# EAGLE design Sceme (EAGLE 9.6.2)
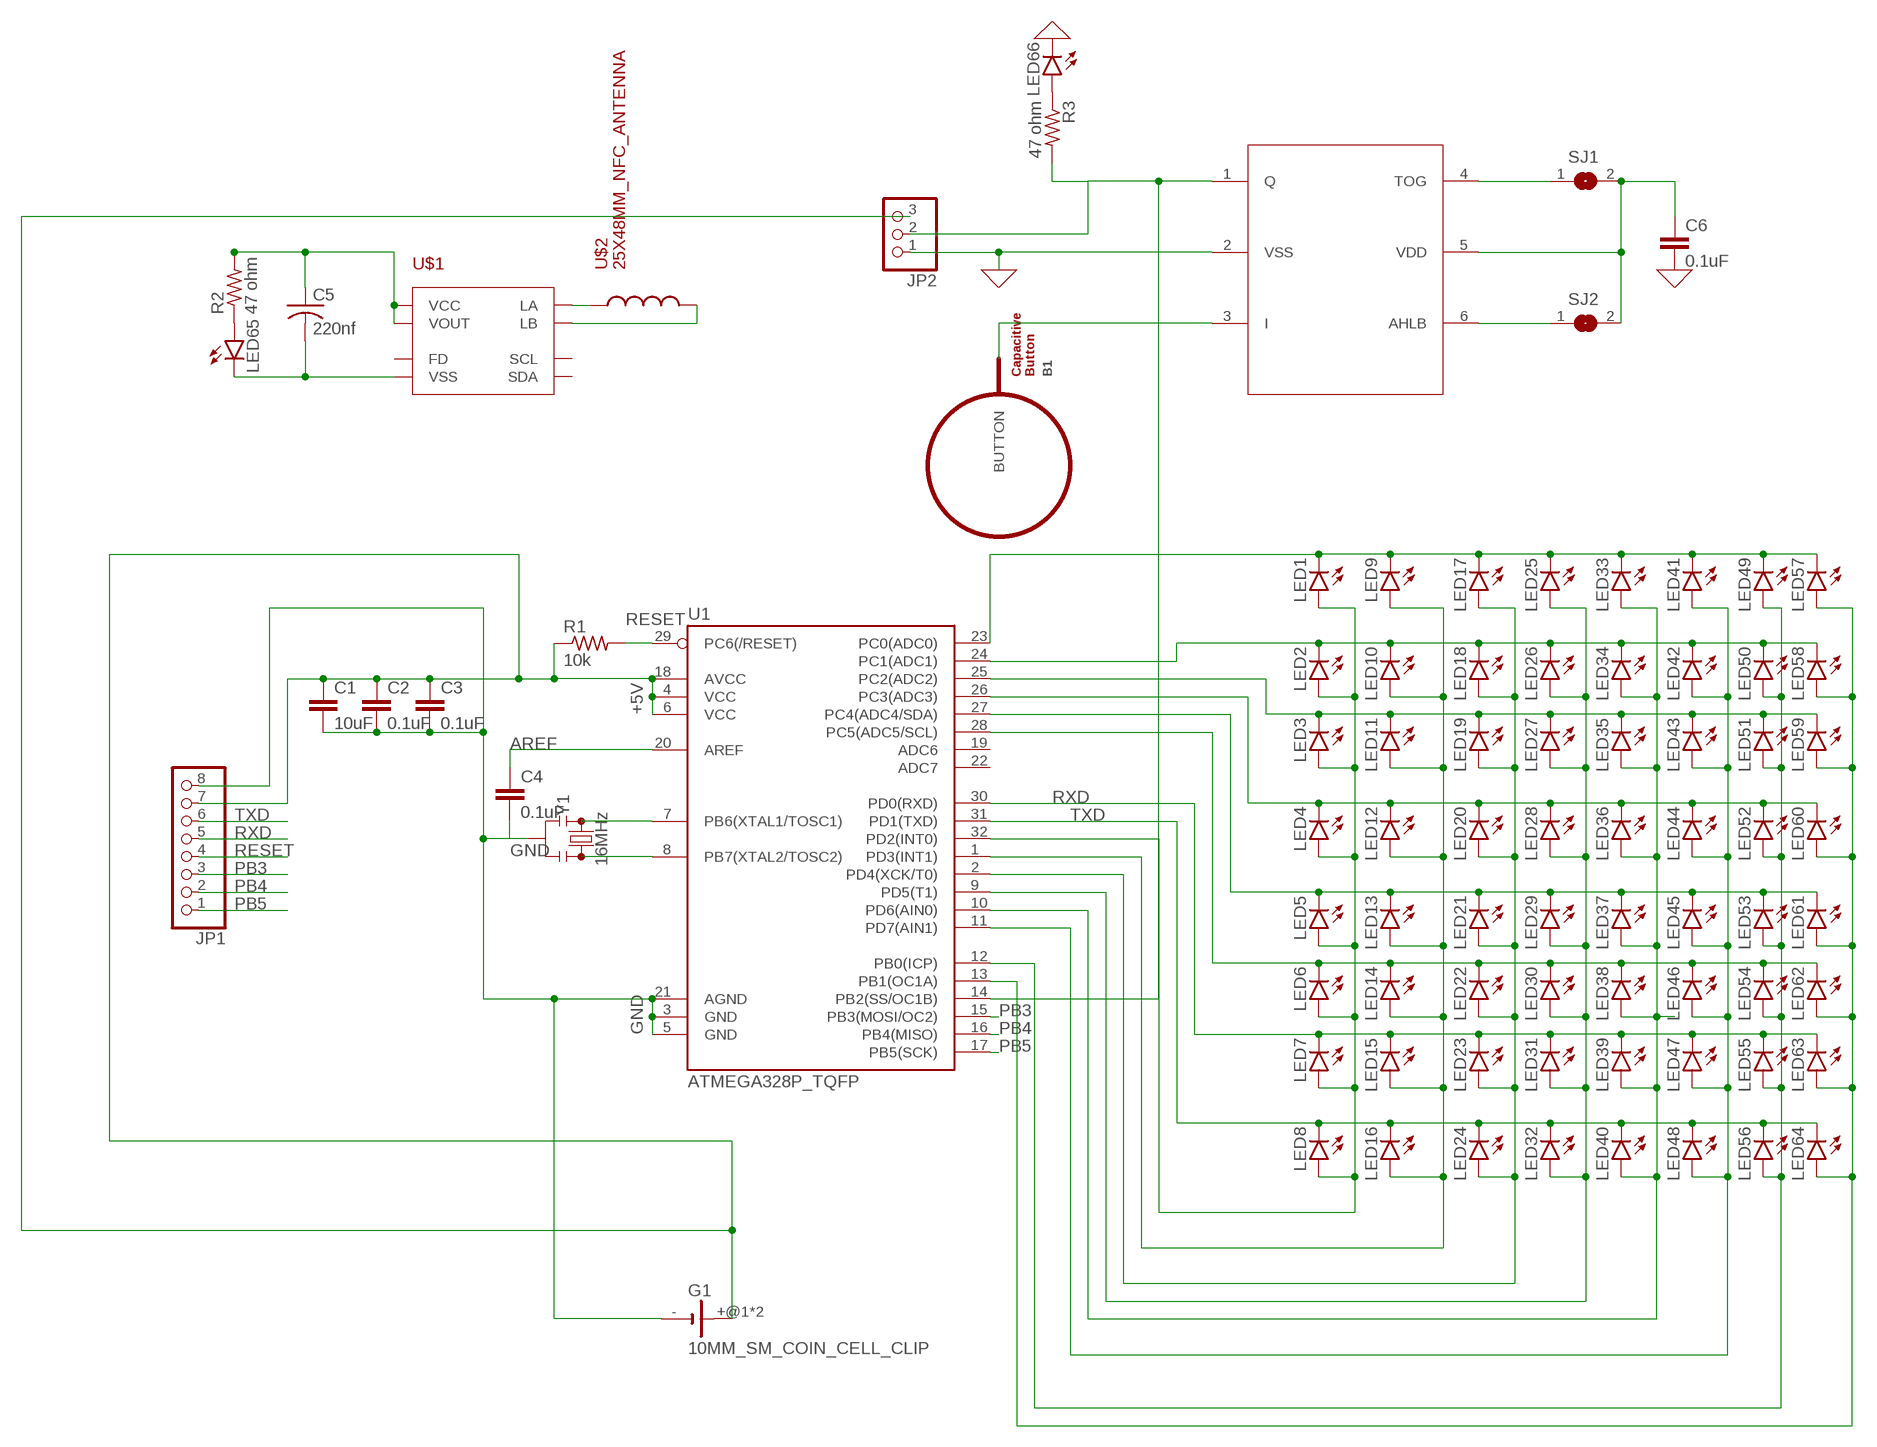
[diagram p0: schematic, sheet 1]
U$7 (TTP223): S: s
U$8 (TTP223): S: s

## Parts
B1  BUTTON_PASSIVE8MM  [BUTTON_PASSIVE_8MM]
C1  10uF  C-EUC0603  [C0603]
C2  0.1uF  C-EUC0603  [C0603]
C3  0.1uF  C-EUC0603  [C0603]
C4  0.1uF  C-EUC0603  [C0603]
C5  220nf  C-USC0805  [C0805]
C6  0.1uF  C-EUC0603  [C0603]
G1  10MM_SM_COIN_CELL_CLIP  [10MM_SM_COIN_CELL_CLIP]
JP1  PINHD-1X8  [1X08]
JP2  PINHD-1X3  [1X03]
LED1  LED  [SMARTLED-TTW]
LED2  LED  [SMARTLED-TTW]
LED3  LED  [SMARTLED-TTW]
LED4  LED  [SMARTLED-TTW]
LED5  LED  [SMARTLED-TTW]
LED6  LED  [SMARTLED-TTW]
LED7  LED  [SMARTLED-TTW]
LED8  LED  [SMARTLED-TTW]
LED9  LED  [SMARTLED-TTW]
LED10  LED  [SMARTLED-TTW]
LED11  LED  [SMARTLED-TTW]
LED12  LED  [SMARTLED-TTW]
LED13  LED  [SMARTLED-TTW]
LED14  LED  [SMARTLED-TTW]
LED15  LED  [SMARTLED-TTW]
LED16  LED  [SMARTLED-TTW]
LED17  LED  [SMARTLED-TTW]
LED18  LED  [SMARTLED-TTW]
LED19  LED  [SMARTLED-TTW]
LED20  LED  [SMARTLED-TTW]
LED21  LED  [SMARTLED-TTW]
LED22  LED  [SMARTLED-TTW]
LED23  LED  [SMARTLED-TTW]
LED24  LED  [SMARTLED-TTW]
LED25  LED  [SMARTLED-TTW]
LED26  LED  [SMARTLED-TTW]
LED27  LED  [SMARTLED-TTW]
LED28  LED  [SMARTLED-TTW]
LED29  LED  [SMARTLED-TTW]
LED30  LED  [SMARTLED-TTW]
LED31  LED  [SMARTLED-TTW]
LED32  LED  [SMARTLED-TTW]
LED33  LED  [SMARTLED-TTW]
LED34  LED  [SMARTLED-TTW]
LED35  LED  [SMARTLED-TTW]
LED36  LED  [SMARTLED-TTW]
LED37  LED  [SMARTLED-TTW]
LED38  LED  [SMARTLED-TTW]
LED39  LED  [SMARTLED-TTW]
LED40  LED  [SMARTLED-TTW]
LED41  LED  [SMARTLED-TTW]
LED42  LED  [SMARTLED-TTW]
LED43  LED  [SMARTLED-TTW]
LED44  LED  [SMARTLED-TTW]
LED45  LED  [SMARTLED-TTW]
LED46  LED  [SMARTLED-TTW]
LED47  LED  [SMARTLED-TTW]
LED48  LED  [SMARTLED-TTW]
LED49  LED  [SMARTLED-TTW]
LED50  LED  [SMARTLED-TTW]
LED51  LED  [SMARTLED-TTW]
LED52  LED  [SMARTLED-TTW]
LED53  LED  [SMARTLED-TTW]
LED54  LED  [SMARTLED-TTW]
LED55  LED  [SMARTLED-TTW]
LED56  LED  [SMARTLED-TTW]
LED57  LED  [SMARTLED-TTW]
LED58  LED  [SMARTLED-TTW]
LED59  LED  [SMARTLED-TTW]
LED60  LED  [SMARTLED-TTW]
LED61  LED  [SMARTLED-TTW]
LED62  LED  [SMARTLED-TTW]
LED63  LED  [SMARTLED-TTW]
LED64  LED  [SMARTLED-TTW]
LED65  LEDSML0805  [SML0805]
LED66  LEDSML0805  [SML0805]
R1  10k  R-US_R0603  [R0603]
R2  47 ohm  R-US_R0805  [R0805]
R3  47 ohm  R-US_R0805  [R0805]
SJ1  SJ  [SJ]
SJ2  SJ  [SJ]
U1  ATMEGA328P_TQFP  [TQFP32-08]
U$1  NT3H  [XQFN8]
U$2  25X48MM_NFC_ANTENNA  [25X48MM_NFC_ANTENNA]
U$9  TTP223  [SOT23-6]
Y1  16MHz  RESONATOR-16MHZSMD_3.2X1.3  [RESONATOR-SMD-3.2X1.3]

## Nets
0: C6.2 JP2.1 LED66.C U$9.2(VSS) ; supply symbol labelled GND
+5V: C1.1 C2.1 C3.1 G1.+@1(+) G1.+@2(+) JP1.7 JP2.3 R1.1 U1.4(VCC) U1.6(VCC) U1.18(AVCC)
AREF: C4.1 U1.20(AREF)
GND: C1.2 C2.2 C3.2 C4.2 G1.- JP1.8 U1.3(GND) U1.5(GND) U1.21(AGND) Y1.2
N$1: LED1.C@1(C) LED9.C@1(C) LED17.C@1(C) LED25.C@1(C) LED33.C@1(C) LED41.C@1(C) LED49.C@1(C) LED57.C@1(C) U1.23(PC0(ADC0))
N$2: LED2.C@1(C) LED10.C@1(C) LED18.C@1(C) LED26.C@1(C) LED34.C@1(C) LED42.C@1(C) LED50.C@1(C) LED58.C@1(C) U1.24(PC1(ADC1))
N$3: LED3.C@1(C) LED11.C@1(C) LED19.C@1(C) LED27.C@1(C) LED35.C@1(C) LED43.C@1(C) LED51.C@1(C) LED59.C@1(C) U1.25(PC2(ADC2))
N$4: LED4.C@1(C) LED12.C@1(C) LED20.C@1(C) LED28.C@1(C) LED36.C@1(C) LED44.C@1(C) LED52.C@1(C) LED60.C@1(C) U1.26(PC3(ADC3))
N$5: LED5.C@1(C) LED13.C@1(C) LED21.C@1(C) LED29.C@1(C) LED37.C@1(C) LED45.C@1(C) LED53.C@1(C) LED61.C@1(C) U1.27(PC4(ADC4/SDA))
N$6: LED6.C@1(C) LED14.C@1(C) LED22.C@1(C) LED30.C@1(C) LED38.C@1(C) LED46.C@1(C) LED54.C@1(C) LED62.C@1(C) U1.28(PC5(ADC5/SCL))
N$7: U$1.LA U$2.P$1
N$8: U$1.LB U$2.P$2
N$9: LED1.A@1(A) LED2.A@1(A) LED3.A@1(A) LED4.A@1(A) LED5.A@1(A) LED6.A@1(A) LED7.A@1(A) LED8.A@1(A) U1.32(PD2(INT0))
N$10: LED9.A@1(A) LED10.A@1(A) LED11.A@1(A) LED12.A@1(A) LED13.A@1(A) LED14.A@1(A) LED15.A@1(A) LED16.A@1(A) U1.1(PD3(INT1))
N$11: LED17.A@1(A) LED18.A@1(A) LED19.A@1(A) LED20.A@1(A) LED21.A@1(A) LED22.A@1(A) LED23.A@1(A) LED24.A@1(A) U1.2(PD4(XCK/T0))
N$12: LED25.A@1(A) LED26.A@1(A) LED27.A@1(A) LED28.A@1(A) LED29.A@1(A) LED30.A@1(A) LED31.A@1(A) LED32.A@1(A) U1.9(PD5(T1))
N$13: LED33.A@1(A) LED34.A@1(A) LED35.A@1(A) LED36.A@1(A) LED37.A@1(A) LED38.A@1(A) LED39.A@1(A) LED40.A@1(A) U1.10(PD6(AIN0))
N$14: LED41.A@1(A) LED42.A@1(A) LED43.A@1(A) LED44.A@1(A) LED45.A@1(A) LED46.A@1(A) LED47.A@1(A) LED48.A@1(A) U1.11(PD7(AIN1))
N$15: LED49.A@1(A) LED50.A@1(A) LED51.A@1(A) LED52.A@1(A) LED53.A@1(A) LED54.A@1(A) LED55.A@1(A) LED56.A@1(A) U1.12(PB0(ICP))
N$16: LED57.A@1(A) LED58.A@1(A) LED59.A@1(A) LED60.A@1(A) LED61.A@1(A) LED62.A@1(A) LED63.A@1(A) LED64.A@1(A) U1.13(PB1(OC1A))
N$17: U1.7(PB6(XTAL1/TOSC1)) Y1.1
N$18: U1.8(PB7(XTAL2/TOSC2)) Y1.3
N$19: LED65.A R2.1
N$20: C5.1 R2.2 U$1.VCC U$1.VOUT
N$21: C5.2 LED65.C U$1.VSS
N$22: LED66.A R3.1
N$23: JP2.2 R3.2 U1.14(PB2(SS/OC1B)) U$9.1(Q)
N$24: B1.BUTTON U$9.3(I)
N$25: SJ1.1 U$9.4(TOG)
N$26: SJ2.1 U$9.6(AHLB)
N$27: C6.1 SJ1.2 SJ2.2 U$9.5(VDD)
PB3: JP1.3 U1.15(PB3(MOSI/OC2))
PB4: JP1.2 U1.16(PB4(MISO))
PB5: JP1.1 U1.17(PB5(SCK))
RESET: JP1.4 R1.2 U1.29(PC6(/RESET))
RXD: JP1.5 LED7.C@1(C) LED15.C@1(C) LED23.C@1(C) LED31.C@1(C) LED39.C@1(C) LED47.C@1(C) LED55.C@1(C) LED63.C@1(C) U1.30(PD0(RXD))
TXD: JP1.6 LED8.C@1(C) LED16.C@1(C) LED24.C@1(C) LED32.C@1(C) LED40.C@1(C) LED48.C@1(C) LED56.C@1(C) LED64.C@1(C) U1.31(PD1(TXD))
Unconnected: U1.19(ADC6) U1.22(ADC7) U$1.FD U$1.SCL U$1.SDA

## Library data of the parts
B1 = PatternAgents-TouchWidgets:BUTTON_PASSIVE: Button, Passive Capacitive/Touch Sensing Type Source : http://www.PatternAgents.com Github : https://github.com/PatternAgents License : http://creativecommons.org/licenses/by-sa/3.1/ (Creative Commons 3.1) THIS SOFTWARE IS PROVIDED BY THE CONTRIBUTORS "AS IS" AND WITHOUT ANY EXPRESS OR IMPLIED WARRANTIES, INCLUDING, BUT NOT LIMITED TO, THE IMPLIED WARRANTIES OF MERCHANTABILITY AND FITNESS FOR A PARTICULAR PURPOSE ARE DISCLAIMED. IN NO EVENT SHALL THE COPYRIGHT OWNER OR CONTRIBUTORS BE LIABLE FOR ANY DIRECT, INDIRECT, INCIDENTAL, SPECIAL, EXEMPLARY, OR CONSEQUENTIAL DAMAGES (INCLUDING, BUT NOT LIMITED TO, PROCUREMENT OF SUBSTITUTE GOODS OR SERVICES; LOSS OF USE, DATA, OR PROFITS; OR BUSINESS INTERRUPTION) HOWEVER CAUSED AND ON ANY THEORY OF LIABILITY, WHETHER IN CONTRACT, STRICT LIABILITY, OR TORT (INCLUDING NEGLIGENCE OR OTHERWISE) ARISING IN ANY WAY OUT OF THE USE OF THIS SOFTWARE, EVEN IF ADVISED OF THE POSSIBILITY OF SUCH DAMAGE.
C1-C4 C6 = rcl:C-EU: CAPACITOR, European symbol; SPICEPREFIX: C
C5 = adafruit:C-US: CAPACITOR, American symbol
G1 = battery:10MM_SM_COIN_CELL_CLIP: Battery cell clip for CR927 Source: KEYSTONE ELECTRONICS CORP. www.keyelco.com, ASTORIA, N.Y. 11105-2017 PART ANME 10mm SM COIN CELl CLIP DWG NO. 3030
JP1 = pinhead:PINHD-1X8: PIN HEADER
JP2 = adafruit:PINHD-1X3: PIN HEADER
LED1-LED66 = led:LED: LED OSRAM: - CHIPLED LG R971, LG N971, LY N971, LG Q971, LY Q971, LO R971, LY R971 LH N974, LH R974 LS Q976, LO Q976, LY Q976 LO Q996 - Hyper CHIPLED LW Q18S LB Q993, LB Q99A, LB R99A - SideLED LS A670, LO A670, LY A670, LG A670, LP A670 LB A673, LV A673, LT A673, LW A673 LH A674 LY A675 LS A676, LA A676, LO A676, LY A676, LW A676 LS A679, LY A679, LG A679 - Hyper Micro SIDELED® LS Y876, LA Y876, LO Y876, LY Y876 LT Y87S - SmartLED LW L88C, LW L88S LB L89C, LB L89S, LG L890 LS L89K, LO L89K, LY L89K LS L896, LA L896, LO L896, LY L896 - TOPLED LS T670, LO T670, LY T670, LG T670, LP T670 LSG T670, LSP T670, LSY T670, LOP T670, LYG T670 LG T671, LOG T671, LSG T671 LB T673, LV T673, LT T673, LW T673 LH T674 LS T676, LA T676, LO T676, LY T676, LB T676, LH T676, LSB T676, LW T676 LB T67C, LV T67C, LT T67C, LS T67K, LO T67K, LY T67K, LW E67C LS E67B, LA E67B, LO E67B, LY E67B, LB E67C, LV E67C, LT E67C LW T67C LS T679, LY T679, LG T679 LS T770, LO T770, LY T770, LG T770, LP T770 LB T773, LV T773, LT T773, LW T773 LH T774 LS E675, LA E675, LY E675, LS T675 LS T776, LA T776, LO T776, LY T776, LB T776 LHGB T686 LT T68C, LB T68C - Hyper Mini TOPLED® LB M676 - Mini TOPLED Santana® LG M470 LS M47K, LO M47K, LY M47K Source: http://www.osram.convergy.de LUXEON: - LUMILED® LXK2-PW12-R00, LXK2-PW12-S00, LXK2-PW14-U00, LXK2-PW14-V00 LXK2-PM12-R00, LXK2-PM12-S00, LXK2-PM14-U00 LXK2-PE12-Q00, LXK2-PE12-R00, LXK2-PE12-S00, LXK2-PE14-T00, LXK2-PE14-U00 LXK2-PB12-K00, LXK2-PB12-L00, LXK2-PB12-M00, LXK2-PB14-N00, LXK2-PB14-P00, LXK2-PB14-Q00 LXK2-PR12-L00, LXK2-PR12-M00, LXK2-PR14-Q00, LXK2-PR14-R00 LXK2-PD12-Q00, LXK2-PD12-R00, LXK2-PD12-S00 LXK2-PH12-R00, LXK2-PH12-S00 LXK2-PL12-P00, LXK2-PL12-Q00, LXK2-PL12-R00 Source: www.luxeon.com KINGBRIGHT: KA-3528ASYC Source: www.kingbright.com
R1 = rcl:R-US_: RESISTOR, American symbol; SPICEPREFIX: R
R2 R3 = adafruit:R-US_: RESISTOR, American symbol
SJ1 SJ2 = jumper:SJ: SMD solder JUMPER
U1 = a_personal:ATMEGA328P_TQFP; PROD_ID: IC-09069
U$1 = FQV3JXVJRBBMXRR:NT3H: NXP NTAG NT3H
U$2 = FQV3JXVJRBBMXRR:25X48MM_NFC_ANTENNA: 25x48 mm NFC loop antenna, L = 2,75 µH
U$9 = To2223:TTP223; S: s
Y1 = a_personal:RESONATOR-16MHZ: 16MHz Resonator Digikey Example <http://www.digikey.com/product-detail/en/murata-electronics-north-america/CSTCE16M0V53-R0/490-1198-1-ND/584635> Frequency: 16MHz Frequency Stability: ±0.3% Frequency Tolerance: ±0.5% Capacitance: 15pF; PROD_ID: XTAL-08900

## Board
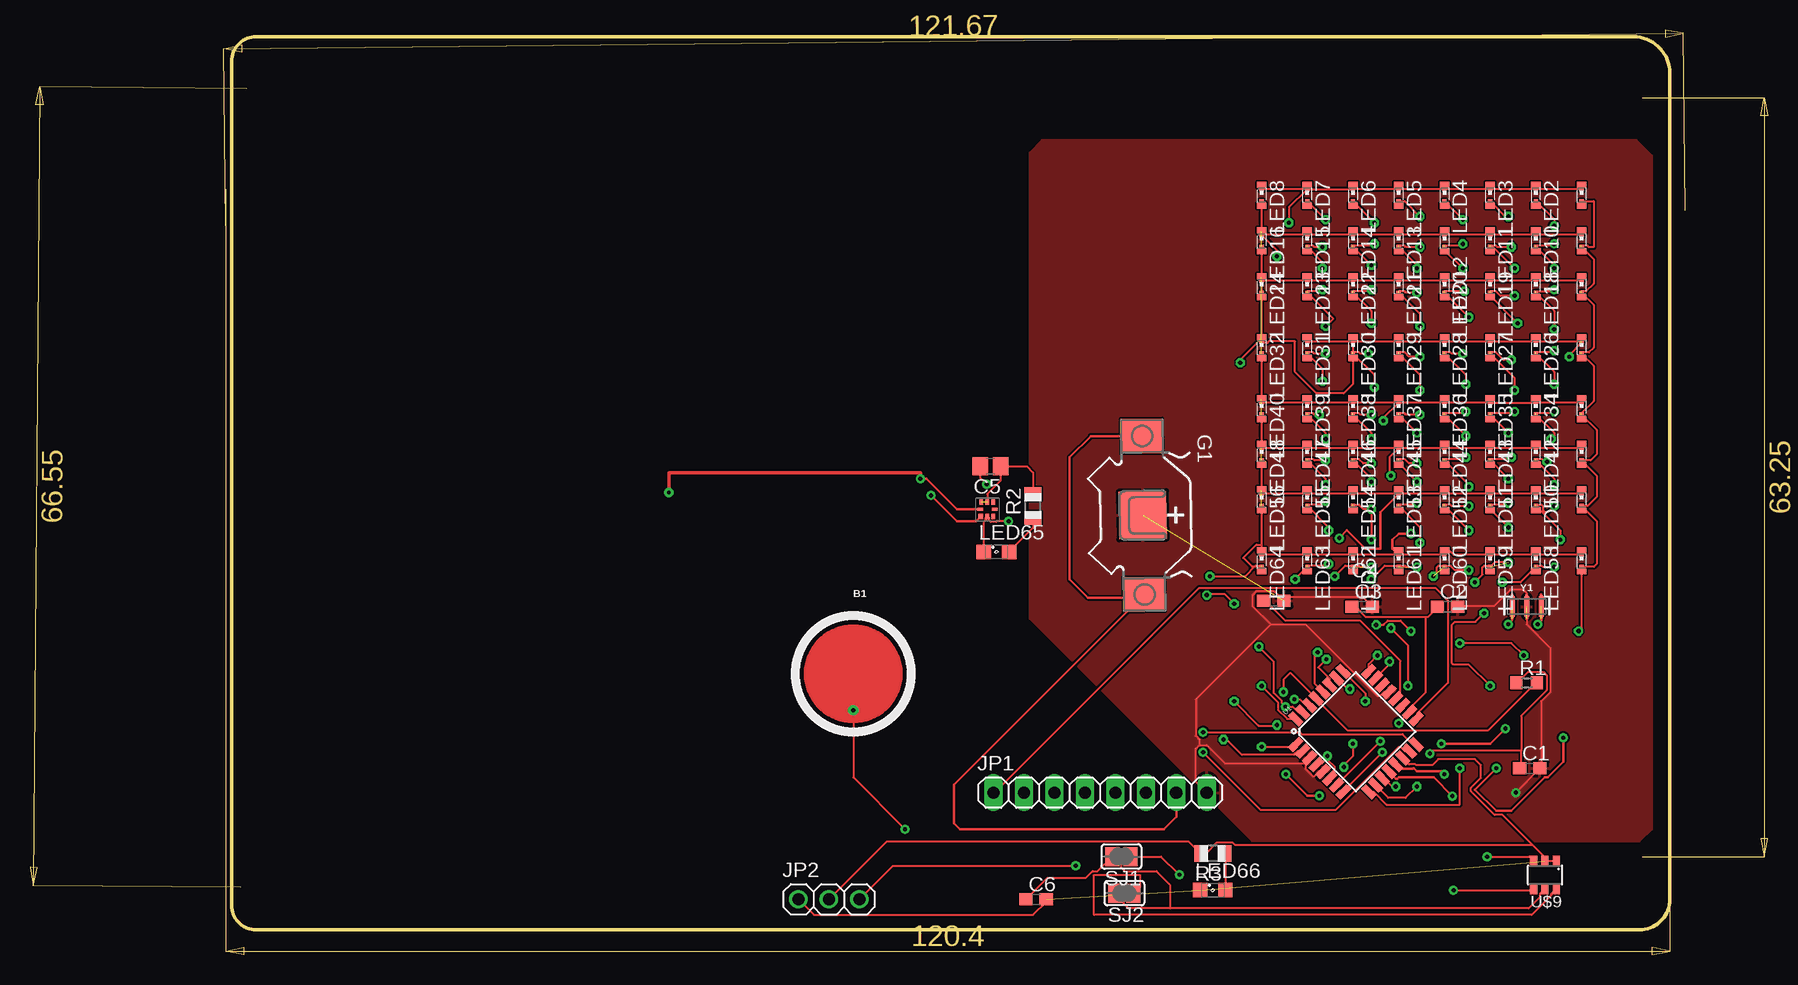
[diagram p1: board, top side]
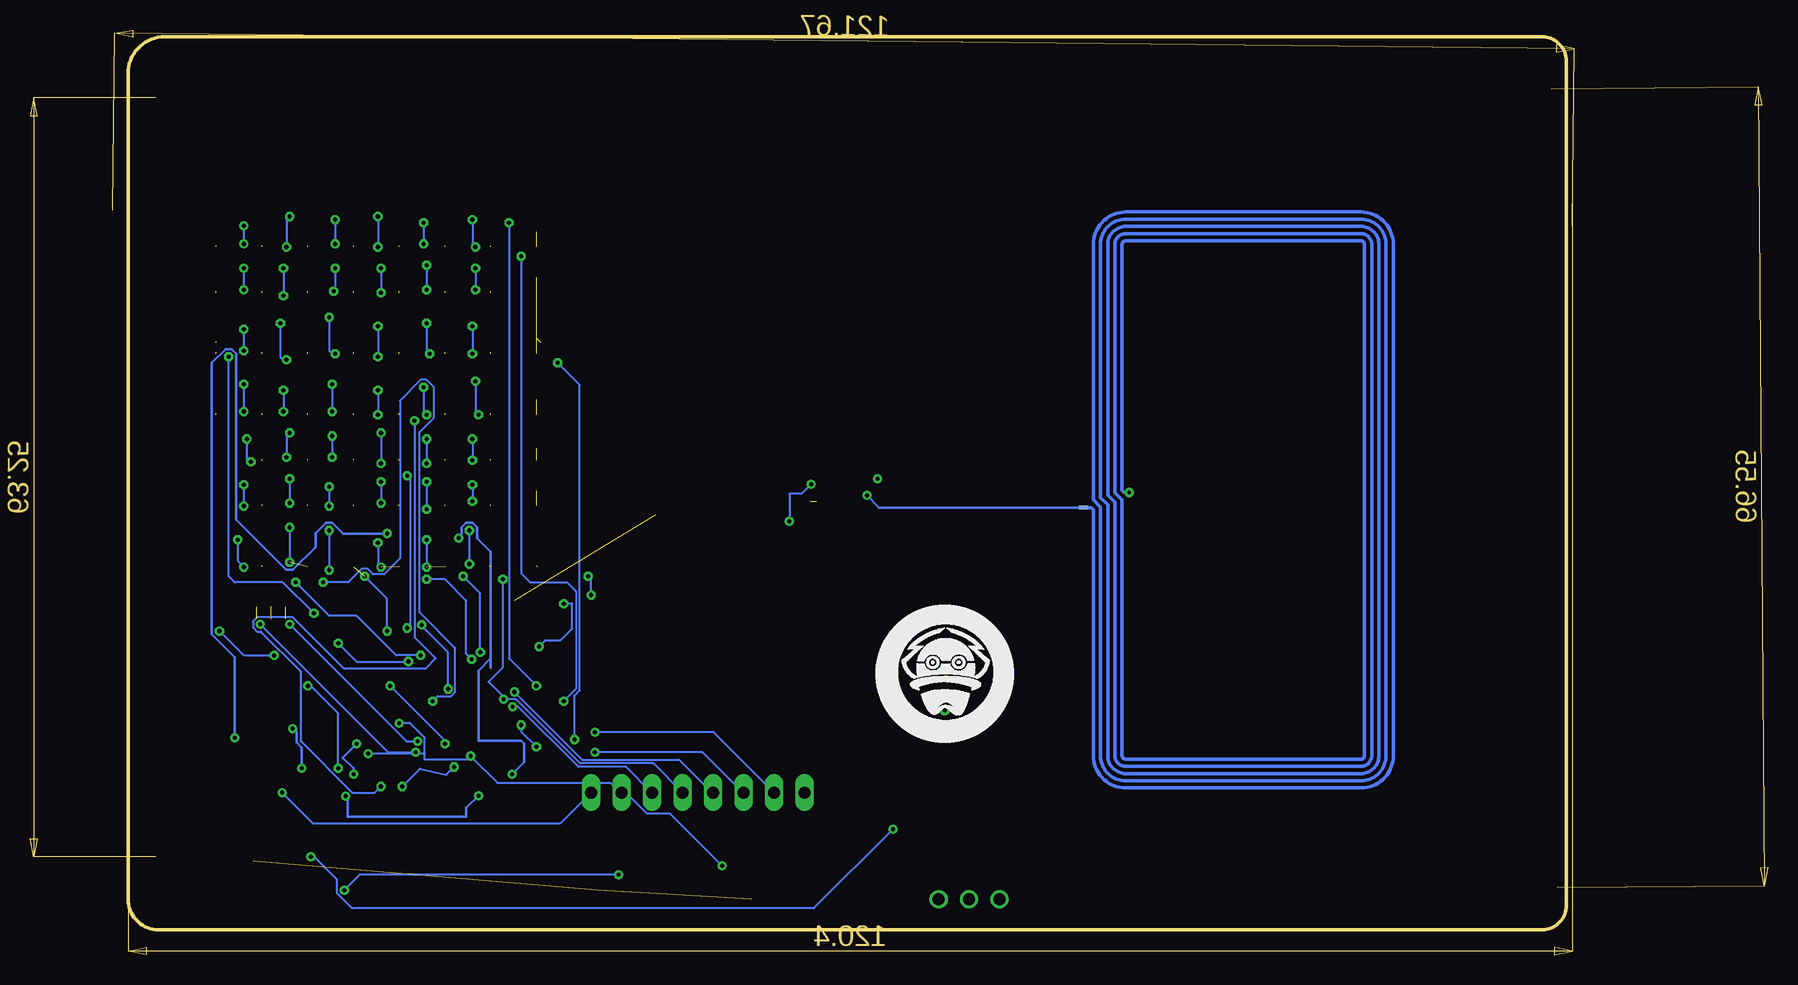
[diagram p2: board, bottom side, seen from below]

Size 119.89 x 74.42 mm. Coordinates in mm from the lower left corner, seen from the top.
Outline: 0,72.39 0,2.03 arc90 2.03,0 117.35,0 arc90 119.89,2.54 119.89,71.37 arc90 116.84,74.42 2.03,74.42 arc90 0,72.39
Copper layers (1*16): Top 0.035mm / dielectric 1.5mm / Bottom 0.035mm
Design rules "default": minimum track width 6mil, minimum drill 0.35mm, track to track 6mil, track to pad 6mil, pad to pad 6mil, via to via 6mil, smd to smd 6mil, copper to edge 40mil, drill to drill 6mil, minimum pad ring 10mil, minimum via ring 8mil, stop-mask expansion 4mil, vias tented up to drill 0mil, thermal gap 10mil

### Footprints (pad centres in the part's own frame; a part is rotated, then mirrored left to right if it is on the bottom)
BUTTON_PASSIVE_8MM = drill 0.356: BUTTON 0,3.048
C0603 = smd 1.1 x 1: 1 -0.85,0; 2 0.85,0
C0805 = smd 1.3 x 1.5: 1 -0.85,0; 2 0.85,0
10MM_SM_COIN_CELL_CLIP = smd 2.9 x 3.5: +@1 -6.6,0; +@2 6.6,0 | smd 3.96 x 3.96: - 0,0
1X08 = drill 1.016 long: 1 -8.89,0; 2 -6.35,0; 3 -3.81,0; 4 -1.27,0; 5 1.27,0; 6 3.81,0; 7 6.35,0; 8 8.89,0
1X03 = drill 1.016: 1 -2.54,0; 2 0,0; 3 2.54,0
SMARTLED-TTW = smd 0.8 x 0.5: A 0,-0.875; C 0,0.875 | smd 0.35 x 0.35: A@1 0,-0.5; C@1 0,0.5
SML0805 = smd 1.2 x 1.2: A 1.05,0; C -1.05,0
R0603 = smd 1 x 1.1: 1 -0.85,0; 2 0.85,0
R0805 = smd 1.1 x 1.4: 1 -1,0; 2 1,0
SJ = smd 1.168 x 1.6: 1 -0.762,0; 2 0.762,0
TQFP32-08 = smd 1.27 x 0.559: 1 -4.293,2.8; 2 -4.293,2; 3 -4.293,1.2; 4 -4.293,0.4; 5 -4.293,-0.4; 6 -4.293,-1.2; 7 -4.293,-2; 8 -4.293,-2.8; 17 4.293,-2.8; 18 4.293,-2; 19 4.293,-1.2; 20 4.293,-0.4; 21 4.293,0.4; 22 4.293,1.2; 23 4.293,2; 24 4.293,2.8 | smd 0.559 x 1.27: 9 -2.8,-4.293; 10 -2,-4.293; 11 -1.2,-4.293; 12 -0.4,-4.293; 13 0.4,-4.293; 14 1.2,-4.293; 15 2,-4.293; 16 2.8,-4.293; 25 2.8,4.293; 26 2,4.293; 27 1.2,4.293; 28 0.4,4.293; 29 -0.4,4.293; 30 -1.2,4.293; 31 -2,4.293; 32 -2.8,4.293
XQFN8 = smd 0.27 x 0.45: FD 0,-0.6; LB 0,0.6 | smd 0.45 x 0.37: LA -0.6,0.55 | smd 0.45 x 0.27: SCL -0.6,-0.5; SDA 0.6,-0.5; VCC 0.6,0; VOUT 0.6,0.5; VSS -0.6,0
25X48MM_NFC_ANTENNA = smd 0.3 x 0.75: P$1 -0.635,13.335 | drill 0.3: P$2 0.635,9.525
SOT23-6 = smd 0.6 x 0.9: 1 -0.95,-1.15; 2 0,-1.15; 3 0.95,-1.15; 4 0.95,1.15; 5 0,1.15; 6 -0.95,1.15
RESONATOR-SMD-3.2X1.3 = smd 0.45 x 1.905: 1 -1.2,0; 2 0,0; 3 1.2,0

### Placement (x,y rotation side)
B1  51.82,21.34 180 top
C1  108.2,13.46 0 top
C2  101.35,26.92 0 top
C3  94.23,26.92 0 top
C4  86.87,27.43 0 top
C5  63.25,38.61 180 top
C6  67.06,2.54 0 top
G1  75.95,34.54 270.9 top
JP1  72.39,11.43 0 top
JP2  49.78,2.54 0 top
LED1  112.52,61.21 180 top
LED2  108.71,61.21 180 top
LED3  104.9,61.21 180 top
LED4  101.09,61.21 180 top
LED5  97.28,61.21 180 top
LED6  93.47,61.21 180 top
LED7  89.66,61.21 180 top
LED8  85.85,61.21 180 top
LED9  112.52,57.4 180 top
LED10  108.71,57.4 180 top
LED11  104.9,57.4 180 top
LED12  101.09,57.4 180 top
LED13  97.28,57.4 180 top
LED14  93.47,57.4 180 top
LED15  89.66,57.4 180 top
LED16  85.85,57.4 180 top
LED17  112.52,53.59 180 top
LED18  108.71,53.59 180 top
LED19  104.9,53.59 180 top
LED20  101.09,53.59 180 top
LED21  97.28,53.59 180 top
LED22  93.47,53.59 180 top
LED23  89.66,53.59 180 top
LED24  85.85,53.59 180 top
LED25  112.52,48.51 180 top
LED26  108.71,48.51 180 top
LED27  104.9,48.51 180 top
LED28  101.09,48.51 180 top
LED29  97.28,48.51 180 top
LED30  93.47,48.51 180 top
LED31  89.66,48.51 180 top
LED32  85.85,48.51 180 top
LED33  112.52,43.43 180 top
LED34  108.71,43.43 180 top
LED35  104.9,43.43 180 top
LED36  101.09,43.43 180 top
LED37  97.28,43.43 180 top
LED38  93.47,43.43 180 top
LED39  89.66,43.43 180 top
LED40  85.85,43.43 180 top
LED41  112.52,39.62 180 top
LED42  108.71,39.62 180 top
LED43  104.9,39.62 180 top
LED44  101.09,39.62 180 top
LED45  97.28,39.62 180 top
LED46  93.47,39.62 180 top
LED47  89.66,39.62 180 top
LED48  85.85,39.62 180 top
LED49  112.52,35.81 180 top
LED50  108.71,35.81 180 top
LED51  104.9,35.81 180 top
LED52  101.09,35.81 180 top
LED53  97.28,35.81 180 top
LED54  93.47,35.81 180 top
LED55  89.66,35.81 180 top
LED56  85.85,35.81 180 top
LED57  112.52,30.73 180 top
LED58  108.71,30.73 180 top
LED59  104.9,30.73 180 top
LED60  101.09,30.73 180 top
LED61  97.28,30.73 180 top
LED62  93.47,30.73 180 top
LED63  89.66,30.73 180 top
LED64  85.85,30.73 180 top
LED65  63.75,31.5 0 top
LED66  81.79,3.3 0 top
R1  107.95,20.57 0 top
R2  66.8,35.31 90 top
R3  81.79,6.35 180 top
SJ1  74.17,6.1 180 top
SJ2  74.42,3.05 180 top
U1  93.73,16.51 45 top
U$1  62.99,35.05 90 top
U$2  26.92,35.81 90 bottom
U$9  109.47,4.57 180 top
Y1  107.95,26.92 0 top

### Tracks (layer width: path | path; a pad name or v marks a point on that pad's centre or on a via)
0  (2 unrouted)
  Top 0.152: JP2.1 48.54,1.25 66.8,1.25 67.91,2.35 C6.2
+5V  (via drill 0.35)
  Top 0.152: 99.52,26.06 99.72,26.06 100.48,26.82 C2.1 | 99.52,26.06 94.54,26.06 93.78,26.82 93.47,26.82 C3.1 | 99.52,26.06 99.52,19.76 98.2,18.44 98.2,18.14 U1.18 98.04,17.98 v97.28,17.22 | 107.49,14.94 107.49,17.83 109.63,19.96 109.63,21.18 109.32,21.49 108.1,21.49 107.19,20.57 R1.1 | C1.1 107.49,13.56 107.49,14.94 | 91.34,14.17 91.19,14.17 90.88,13.87 90.42,13.87 U1.4 | 91.34,14.17 91.95,13.56 91.95,12.95 91.64,12.65 U1.6 | v91.34,14.48 91.34,14.17 | v99.87,14.68 100.13,14.94 107.49,14.94 | JP2.3 55.12,5.33 v70.36,5.33
  Top 0.203: G1.+@2 76,27.89 | 76,27.89 60.2,12.09 60.2,8.89 60.71,8.38 77.72,8.38 78.74,9.4 JP1.7 | G1.+@1 71.62,41.14 69.85,39.37 69.85,29.21 71.37,27.69 76.71,27.69 76.5,27.89 76,27.89
  Bottom 0.152: 95.15,14.68 v99.87,14.68 | v97.28,17.22 96.37,17.22 95.15,16 95.15,14.68 | 95.15,14.68 95.15,14.17 91.64,14.17 v91.34,14.48 89.1,12.24 79.65,12.24 78.84,11.43 JP1.7 78.36,11.43 76.61,9.68 74.7,9.68 v70.36,5.33
AREF
  Top 0.152: C4.1 86.16,27.43 87.83,25.76 94.08,25.76 97.43,22.4 97.43,19.66 97.13,19.36 U1.20
GND  (via drill 0.35)  (2 unrouted)
  Top 0.152: 107.95,25.91 107.95,25.45 109.93,23.47 109.93,19.81 109.17,19.05 109.17,13.56 C1.2 109.02,13.41 v107.04,11.43 | C2.2 102.31,26.98 105.21,26.98 106.58,28.35 107.64,28.35 107.95,28.04 Y1.2 | 89.51,13.87 89.51,13.41 90.12,12.8 90.27,12.8 90.58,13.11 90.88,13.11 U1.5 | 89.51,13.87 89.81,14.17 U1.3 89.51,13.87 | 89.51,13.87 82.8,13.87 81.28,15.39 80.67,15.39 | 80.67,15.39 80.37,15.09 80.37,12.34 JP1.8 | C3.2 95,26.98 94.23,27.74 88.14,27.74 87.83,27.43 C4.2 87.68,27.43 86.92,28.19 85.39,28.19 85.09,27.89 85.09,26.98 86.61,25.45 | 86.61,25.45 89.51,25.45 95.45,19.51 95.76,19.51 96.06,19.81 96.37,19.81 U1.21 | 80.67,15.39 80.67,15.85 80.37,16.15 80.37,19.2 86.61,25.45
  Bottom 0.152: JP1.8 83.82,8.89 104.5,8.89 v107.04,11.43
  pour Top: 82.3,63.5 82.3,15.49 87.12,10.67 111.76,10.67 112.27,11.18 114.05,12.95 114.05,58.67 114.05,62.48 113.03,63.5
  pour Top: 66.55,64.77 66.55,25.91 85.09,7.37 117.35,7.37 118.36,8.38 118.36,64.52 117.09,65.79 67.56,65.79
  pour Top: 62.23,8.13 63.75,6.6 63.75,0.76 113.03,0.76 113.28,1.02 113.54,1.27 113.54,8.13
N$1  (via drill 0.35)  (4 unrouted)
  Top 0.152: LED1.C@1 113.54,60.71 113.54,56.9 113.13,56.9 113.02,57.01 112.52,57.01 | LED9.C@1 113.54,55.89 113.54,53.85 112.89,53.2 112.52,53.2 | LED17.C@1 113.54,52.08 113.54,48.51 113.14,48.12 112.52,48.12 | LED25.C@1 113.54,47 113.54,44.05 112.52,43.04 | LED33.C@1 113.79,41.66 113.79,39.62 113.29,39.12 LED41.C@1 113.79,37.85 113.79,36.07 113.04,35.31 LED49.C@1 113.79,34.04 113.79,30.48 113.55,30.23 LED57.C@1 112.52,25.15 v112.27,24.89 | v107.7,22.86 106.68,23.88 v102.36,23.88 | v96.52,22.35 96.52,22.13 U1.23
  Bottom 0.152: v112.27,24.89 110.24,22.86 v107.7,22.86 | v102.36,23.88 100.84,22.35 v96.52,22.35
N$2  (via drill 0.35)  (7 unrouted)
  Top 0.152: LED2.C@1 110.24,59.19 v110.24,58.67 | v110.24,57.15 110.09,57.01 108.71,57.01 | LED10.C@1 110.24,55.38 v110.24,55.12 | v110.24,53.34 110.09,53.2 108.71,53.2 | LED18.C@1 110.24,51.57 v110.24,50.04 | v110.24,48.26 110.09,48.12 108.71,48.12 | LED26.C@1 110.24,46.49 v110.24,45.47 | v110.24,43.18 110.09,43.04 108.71,43.04 | LED34.C@1 110.24,41.41 110.24,41.15 v109.98,40.89 | 108.71,39.23 109.21,39.23 109.44,38.99 v109.64,38.99 | LED42.C@1 110.24,37.6 v110.24,37.08 | v110.24,35.31 109.73,34.8 109.47,34.8 109.34,34.93 109.34,35.28 109.21,35.42 108.71,35.42 | LED50.C@1 110.74,33.28 v110.74,32.51 | v110.24,30.23 109.32,30.23 109.21,30.34 108.71,30.34 | LED58.C@1 107.43,28.96 v105.92,28.96 | U1.24 94.78,22.14 v95.5,22.86
  Bottom 0.152: v110.24,58.67 v110.24,57.15 | v110.24,55.12 v110.24,53.34 | v110.24,50.04 v110.24,48.26 | v110.24,45.47 v110.24,43.18 | v109.98,40.89 109.98,39.12 109.73,38.86 109.64,38.95 v109.64,38.99 | v110.24,37.08 v110.24,35.31 | v110.74,32.51 110.74,30.73 v110.24,30.23 | v95.5,22.86 97.54,22.86 100.84,26.16 103.12,26.16 v105.92,28.96
N$3  (via drill 0.35)  (7 unrouted)
  Top 0.152: LED3.C@1 106.18,59.44 v106.43,59.44 | v106.68,56.9 105.51,56.9 105.4,57.01 104.9,57.01 | LED11.C@1 105.15,56.9 v106.93,55.12 | 104.9,53.2 105.4,53.2 105.76,52.83 v106.93,52.83 | LED19.C@1 104.9,52.83 v107.19,50.55 | 104.9,48.12 105.4,48.12 106.02,47.5 v106.68,47.5 | LED27.C@1 106.93,45.98 v106.93,44.96 | v106.93,43.18 106.79,43.04 104.9,43.04 | LED35.C@1 v106.43,41.41 v106.43,41.4 | v106.68,39.37 106.54,39.23 104.9,39.23 | LED43.C@1 v106.43,37.6 v106.43,37.59 | v106.43,35.56 106.28,35.42 104.9,35.42 | LED51.C@1 104.9,35.05 v106.43,33.53 | v106.43,30.63 105.3,30.63 105.01,30.34 104.41,30.34 104.27,30.2 104.27,29.6 v103.63,28.96 | U1.25 94.49,19.71 v94.49,19.05
  Bottom 0.152: v106.43,59.44 106.68,59.18 v106.68,56.9 | v106.93,55.12 v106.93,52.83 | v107.19,50.55 107.19,47.75 106.93,47.5 v106.68,47.5 | v106.93,44.96 v106.93,43.18 | v106.43,41.4 106.68,41.15 v106.68,39.37 | v106.43,37.59 v106.43,35.56 | v106.43,33.53 v106.43,30.63 | v94.49,19.05 94.08,19.46 92.97,19.46 92.61,19.81 92.61,23.46 95.6,26.46 95.6,41.46 94.39,42.67 94.39,45.21 95,45.82 95.5,45.82 97.23,44.09 97.23,30.95 98.55,29.62 99.46,29.62 99.91,30.07 100.41,30.07 101.53,28.96 v103.63,28.96
N$4  (via drill 0.35)  (7 unrouted)
  Top 0.152: LED4.C@1 v102.62,59.19 v102.62,59.18 | v102.62,57.15 102.47,57.01 101.09,57.01 | LED12.C@1 101.09,56.64 v102.62,55.12 | v102.74,53.21 101.21,53.21 101.2,53.2 101.09,53.2 | LED20.C@1 v103.12,51.06 v103.12,51.05 | v102.62,48.01 101.7,48.01 101.59,48.12 101.09,48.12 | LED28.C@1 102.87,46.24 v102.87,45.47 | v102.87,43.18 102.73,43.04 101.09,43.04 | LED36.C@1 102.87,41.16 v102.87,41.15 | v102.87,39.37 102.73,39.23 101.09,39.23 | LED44.C@1 103.12,37.09 v103.12,36.92 | v103.12,35.31 101.7,35.31 101.59,35.42 101.09,35.42 | LED52.C@1 v103.12,33.28 v103.12,33.27 | v103.12,29.97 101.95,29.97 101.59,30.34 100.6,30.34 100.46,30.2 100.46,29.77 v100.16,29.46 | U1.26 93,20.07 v93.22,20.07 | 95.5,25.4 v95.41,25.4 96.02,25.4 96.37,25.75 97.44,25.75 v98.3,24.89
  Bottom 0.152: v102.62,59.18 v102.62,57.15 | v102.62,55.12 102.62,53.59 102.87,53.34 v102.74,53.21 | v103.12,51.05 103.12,48.26 102.87,48.01 v102.62,48.01 | v102.87,45.47 v102.87,43.18 | v102.87,41.15 v102.87,39.37 | v103.12,36.92 v103.12,35.31 | v103.12,33.27 v103.12,29.97 | v93.22,20.07 93.22,23.11 95.5,25.4 v95.41,25.4 | v98.3,24.89 98.3,27.6 v100.16,29.46
N$5  (via drill 0.35)  (7 unrouted)
  Top 0.152: LED5.C@1 97.78,60.71 v99.06,59.44 | v99.06,56.9 97.89,56.9 97.78,57.01 97.28,57.01 | LED13.C@1 98.81,55.38 v98.81,55.12 | v98.81,53.09 97.89,53.09 97.78,53.2 97.28,53.2 | LED21.C@1 99.06,51.32 v99.06,50.29 | 97.28,48.12 97.78,48.12 98.14,47.75 v99.06,47.75 | LED29.C@1 99.06,46.24 v99.06,44.96 | v99.06,42.93 97.89,42.93 97.78,43.04 97.28,43.04 | LED37.C@1 v98.81,41.41 v98.81,41.4 | 97.28,39.23 97.78,39.23 98.14,38.86 v98.81,38.86 | LED45.C@1 97.28,38.86 v98.81,37.34 | v98.81,35.56 98.66,35.42 97.28,35.42 | LED53.C@1 99.06,33.54 v99.06,32.26 | v98.81,30.23 97.89,30.23 97.78,30.34 96.12,30.34 v95,29.21 | U1.27 91.54,20.9 90.57,21.87 v91.24,22.55
  Bottom 0.152: v99.06,59.44 v99.06,56.9 | v98.81,55.12 v98.81,53.09 | v99.06,50.29 v99.06,47.75 | v99.06,44.96 v99.06,42.93 | v98.81,41.4 v98.81,38.86 | v98.81,37.34 v98.81,35.56 | v99.06,32.26 99.06,30.48 v98.81,30.23 | v91.24,22.55 91.69,23 91.69,27.43 93.47,29.21 v95,29.21
N$6  (via drill 0.35)  (7 unrouted)
  Top 0.152: LED6.C@1 95.25,58.94 v95.25,58.93 | v95.25,57.15 95.11,57.01 93.47,57.01 | LED14.C@1 v95,55.38 v95,55.37 | v95,53.34 94.85,53.2 93.47,53.2 | LED22.C@1 95,51.57 v95,50.55 | v94.74,48.01 94.08,48.01 93.97,48.12 93.47,48.12 | LED30.C@1 95.25,46.24 v95.25,45.21 | v95,42.93 94.08,42.93 93.97,43.04 93.47,43.04 | LED38.C@1 95,41.41 v95,40.89 | 93.47,39.23 93.97,39.23 94.33,38.86 v95,38.86 | LED46.C@1 95,37.6 v95,37.34 | 93.47,35.42 93.97,35.42 94.33,35.05 v95,35.05 v95,32.51 | v95,30.23 94.08,30.23 93.97,30.34 92.82,30.34 v91.95,29.46 | U1.28 90.27,20.53 90.27,22.86 v90.52,23.11
  Bottom 0.152: v95.25,58.93 v95.25,57.15 | v95,55.37 v95,53.34 | v95,50.55 95,48.26 v94.74,48.01 | v95.25,45.21 95.25,42.93 v95,42.93 | v95,40.89 v95,38.86 | v95,37.34 v95,35.05 | v95,32.51 v95,30.23 | v90.52,23.11 90.52,28.04 v91.95,29.46
N$7  (via drill 0.35)
  Top 0.203: v58.29,36.2 60.45,34.04 62.03,34.04 U$1.LA
  Bottom 0.203: U$2.P$1 57.28,35.18 v58.29,36.2
N$8  (via drill 0.35)
  Top 0.203: U$1.LB 60.45,35.05 57.91,37.59 v57.4,37.59
  Top 0.305: v57.4,37.59 57.4,38.1 36.45,38.1 U$2.P$2
N$9  (via drill 0.35)
  Top 0.152: LED1.A@1 LED2.A@1 LED3.A@1 LED4.A@1 LED5.A@1 LED6.A@1 LED7.A@1 | LED7.A@1 LED8.A@1 | LED7.A@1 88.14,60.19 v88.14,58.93 | v85.85,20.32 87.23,18.95 87.23,18.34 88,17.56 U1.32
  Bottom 0.152: v88.14,58.93 88.14,22.61 v85.85,20.32
N$10  (via drill 0.35)
  Top 0.152: LED9.A@1 LED10.A@1 LED11.A@1 LED12.A@1 LED13.A@1 LED14.A@1 LED15.A@1 LED16.A@1 87.12,56.63 v87.12,56.13 | v83.57,19.05 85.6,17.02 87.12,17.02 v87.12,17.07 | v85.85,15.24 88.5,15.24 U1.1
  Bottom 0.152: v87.12,56.13 87.12,29.72 86.36,28.96 83.31,28.96 82.55,28.19 82.55,20.07 v83.57,19.05 | v87.12,17.07 87.12,16.51 v85.85,15.24
N$11  (via drill 0.35)  (1 unrouted)
  Top 0.152: LED17.A@1 LED18.A@1 LED19.A@1 LED20.A@1 LED21.A@1 LED22.A@1 LED23.A@1 LED24.A@1 85.85,49.28 | U1.2 88.86,14.89 88.55,14.58 84.23,14.58 82.8,16 82.68,15.88 v82.68,15.85 | v84.07,47.24 84.07,47.5 85.45,48.87 85.45,48.91
  Bottom 0.152: v82.68,15.85 82.68,19.51 82.25,19.94 82.25,45.41 v84.07,47.24
N$12  (via drill 0.35)  (2 unrouted)
  Top 0.152: LED25.A@1 LED26.A@1 LED27.A@1 LED28.A@1 LED29.A@1 LED30.A@1 | LED30.A@1 LED31.A@1 | 85.85,48.91 86.35,48.91 86.48,49.04 88.62,49.04 88.65,49.02 88.65,46.48 90.42,44.7 92.71,44.7 93.47,45.47 LED30.A@1 | U1.9 95.19,11.5 96.27,10.42 102.36,10.42 v102.36,13.46 | v104.9,20.32 103.12,22.1 101.85,22.1 101.7,22.25 101.7,25.4 101.96,25.65 103.68,25.65 v104.39,26.37 | v111.51,47.75 111.51,47.89 112.52,48.91
  Bottom 0.152: v102.36,13.46 102.36,18.03 104.65,20.32 v104.9,20.32 | v104.39,26.37 106.98,28.96 111,28.96 111.51,29.46 v111.51,47.75
N$13  (via drill 0.35)
  Top 0.152: LED33.A@1 LED34.A@1 LED35.A@1 LED36.A@1 LED37.A@1 | LED37.A@1 LED38.A@1 LED39.A@1 LED40.A@1 | LED37.A@1 96.01,42.66 v96.01,42.42 | v98.81,11.94 97.86,10.99 96.42,10.99 U1.10
  Bottom 0.152: v96.01,42.42 96.01,24.38 94.23,22.61 95.09,21.75 101.86,21.75 106.17,26.06 109.12,26.06 109.47,25.7 109.47,25.2 109.12,24.84 108.82,24.84 105.51,21.53 105.51,15.75 101.19,11.43 99.31,11.43 v98.81,11.94
N$14  (via drill 0.35)
  Top 0.152: LED41.A@1 LED42.A@1 LED43.A@1 LED44.A@1 LED45.A@1 | LED45.A@1 LED46.A@1 LED47.A@1 LED48.A@1 | LED45.A@1 96.52,39.36 96.52,37.95 v96.62,37.85 | v96.62,25.15 98.04,23.72 v98.04,20.32 | v93.47,15.49 93.47,14.48 92.71,13.72 v92.71,13.57 | U1.11 96.07,12.63 96.77,11.93 96.77,11.94 v97.03,11.94
  Bottom 0.152: v96.62,37.85 96.36,37.59 96.36,25.4 v96.62,25.15 | v98.04,20.32 93.47,15.75 v93.47,15.49 | v92.71,13.57 93.37,12.91 95.54,13.42 v97.03,11.94
N$15  (via drill 0.35)
  Top 0.152: LED49.A@1 LED50.A@1 LED51.A@1 LED52.A@1 LED53.A@1 LED54.A@1 LED55.A@1 LED56.A@1
  Top 0.203: LED53.A@1 95.76,34.79 95.76,31.75 94.49,31.75 92.96,33.27 v92.33,32.64 | v87.88,12.95 89.66,11.18 v90.68,11.18 | v101.75,11.14 100.19,12.7 97.28,12.7 97.15,12.57 97.03,12.57 96.48,13.12 U1.12
  Bottom 0.203: v92.33,32.64 92.07,32.9 92.07,33.54 91.7,33.91 91.18,33.91 90.81,33.54 90.81,32.64 89.66,31.5 89.66,22.61 | 89.66,21.84 89.66,22.61 | 89.66,22.61 90.68,21.59 90.68,15.75 87.12,15.75 86.87,15.49 86.87,13.97 v87.88,12.95 | v90.68,11.18 91.69,10.16 91.69,9.4 101.6,9.4 101.6,11.18 101.64,11.14 v101.75,11.14
N$16  (via drill 0.35)
  Top 0.152: LED57.A@1 LED58.A@1 LED59.A@1 101.86,31.23 101.6,31.5 101.35,31.5 LED60.A@1 LED61.A@1 LED62.A@1 LED63.A@1 LED64.A@1
  Top 0.203: LED61.A@1 96.77,31.74 96.77,32.51 97.28,33.02 v98.3,33.02 | v111,16 111,14 109.71,12.71 109.48,12.71 106.68,9.91 105.41,9.91 103.63,11.68 v105.41,13.46 | v106.17,16.76 104.9,15.49 v100.84,15.49 | v101.09,12.95 100.84,13.21 98.81,13.21 98.55,13.46 98.51,13.46 98.47,13.42 97.38,13.42 U1.13
  Bottom 0.203: v111,16 111,22.73 112.9,24.63 112.9,47.25 111.77,48.38 111.24,48.38 110.87,48.01 110.87,34.18 106.69,29.99 106.16,29.99 104.26,31.9 104.26,33.03 103.39,33.91 102.86,33.91 101.98,33.02 v98.3,33.02 | v105.41,13.46 105.41,15.19 105.84,15.61 105.84,16.51 106.09,16.76 v106.17,16.76 | v100.84,15.49 101.98,14.35 101.09,13.46 v101.09,12.95
N$17  (via drill 0.35)  (1 unrouted)
  Top 0.152: v95.76,15.7 92.25,12.19 U1.7 | v106.43,25.45 106.73,25.76 106.73,25.91 106.75,25.91
  Bottom 0.152: v95.76,15.7 96.67,15.7 v106.43,25.45
N$18  (via drill 0.35)  (1 unrouted)
  Top 0.152: v95.91,14.78 92.71,11.58 U1.8 | v108.86,25.45 109.17,25.76 109.17,25.91 109.15,25.91
  Bottom 0.152: v95.91,14.78 98.2,14.78 v108.86,25.45
N$19
  Top 0.152: R2.1 66.8,33.49 LED65.A
N$20  (1 unrouted)
  Top 0.152: R2.2 66.8,38.1 66.29,38.61 C5.1 64.1,37.43 62.99,36.32 U$1.VCC
N$21  (via drill 0.35)
  Top 0.152: LED65.C 62.7,33.98 62.86,34.13 62.86,34.32 U$1.VSS 63.13,34.32 63.13,34.13 63.26,34 63.72,34 63.76,34.04 v64.77,34.04 | C5.2 62.4,37.68 v62.94,37.13 62.99,37.08
  Bottom 0.152: v62.94,37.13 63.75,36.32 64.77,36.32 v64.77,34.04
N$22
  Top 0.152: R3.1 82.84,6.3 LED66.A
N$23
  Top 0.152: U$9.1 109.78,5.72 108.43,7.08 | 108.43,7.08 105.93,9.58 105.27,9.58 103.3,11.55 103.3,11.82 104.14,12.66 104.14,13.72 103.63,14.22 100.58,14.22 100.08,13.72 98.77,13.72 98.69,13.79 98.14,13.79 U1.14 | 108.43,7.08 83.63,7.08 83.43,7.28 82.14,7.28 81.22,6.35 R3.2 79.77,7.37 54.61,7.37 JP2.2
N$24  (via drill 0.35)
  Top 0.152: B1.BUTTON 51.82,12.7 v56.13,8.38 | v104.65,6.1 108.15,6.1 U$9.3
  Bottom 0.152: v56.13,8.38 62.74,1.78 101.19,1.78 102.46,3.05 102.46,4.16 104.39,6.1 v104.65,6.1
N$25  (via drill 0.35)
  Top 0.152: SJ1.1 77.47,6.1 v78.99,4.57 | v101.85,3.3 108.4,3.3 U$9.4
  Bottom 0.152: v78.99,4.57 100.58,4.57 v101.85,3.3
N$26
  Top 0.152: U$9.6 110,3 110,2.88 108.37,1.25 71.88,1.25 71.88,4.57 75.69,4.57 75.69,3.56 SJ2.1
N$27
  Top 0.152: U$9.5 109.05,3 109.05,2.71 108.12,1.78 78.23,1.78 | SJ2.2 74.37,2.34 74.37,2.15 74.75,1.78 78.23,1.78 | 78.23,1.78 78.23,3.73 77.09,4.88 74.44,4.88 74.12,5.2 74.12,5.38 SJ1.2 72.19,4.88 71.76,4.88 71.2,4.32 67.98,4.32 C6.1
PB3  (via drill 0.35)
  Top 0.152: v80.97,14.78 85.75,10.01 92.05,10.01 97.28,15.24 97.43,15.24 97.74,14.94 98.04,14.94 U1.15
  Bottom 0.152: v80.97,14.78 71.98,14.78 68.63,11.43 JP1.3
PB4  (via drill 0.35)
  Top 0.152: v80.97,16.46 89.05,16.46 89.2,16.31 97.59,16.31 98.35,15.54 98.65,15.54 U1.16
  Bottom 0.152: v80.97,16.46 71.07,16.46 JP1.2
PB5
  Top 0.152: U1.17 98.81,17.68 98.81,17.98 101.4,20.57 101.4,27.43 100.33,28.5 80.67,28.5 63.6,11.43 JP1.1
RESET  (via drill 0.35)
  Top 0.152: R1.2 108.71,20.57 104.75,16.61 93.02,16.61 90.42,19.2 U1.29 88.26,21.41 87.68,20.83 v87.68,19.81
  Bottom 0.152: v87.68,19.81 82.04,14.17 73.97,14.17 71.22,11.43 JP1.4
RXD  (via drill 0.35)  (7 unrouted)
  Top 0.152: v88.59,19.2 89.05,19.2 89.51,18.75 89.81,18.75 U1.30 | LED7.C@1 v91.19,59.19 v91.19,59.18 | v90.93,56.9 90.27,56.9 90.16,57.01 89.66,57.01 | LED15.C@1 90.93,55.63 v90.93,55.12 | v90.93,53.34 90.79,53.2 89.66,53.2 | LED23.C@1 91.83,50.93 v91.19,50.29 | v91.19,48.01 90.27,48.01 90.16,48.12 89.66,48.12 | LED31.C@1 90.93,46.74 v90.93,45.72 | v90.68,42.93 90.27,42.93 90.16,43.04 89.66,43.04 | LED39.C@1 91.19,41.41 v91.19,40.89 | v91.19,39.12 90.27,39.12 90.16,39.23 89.66,39.23 | LED47.C@1 91.19,37.6 v91.19,37.08 | v91.19,35.71 90.9,35.42 89.66,35.42 | LED55.C@1 91.44,33.54 v91.44,33.27 | v91.44,30.48 91.3,30.34 89.66,30.34 | LED63.C@1 v88.65,29.22 v88.65,29.21
  Bottom 0.152: 88.39,19.2 87.53,19.2 82.19,13.87 76.1,13.87 JP1.5 | 88.39,19.2 v88.59,19.2 | v91.19,59.18 91.19,57.15 v90.93,56.9 | v90.93,55.12 v90.93,53.34 | v91.19,50.29 v91.19,48.01 | v90.93,45.72 90.93,43.18 v90.68,42.93 | v91.19,40.89 v91.19,39.12 | v91.19,37.08 v91.19,35.71 | v91.44,33.27 v91.44,30.48 | v88.65,29.21 88.65,21.84 89.84,20.65 88.39,19.2
TXD  (via drill 0.35)  (7 unrouted)
  Top 0.152: U1.31 89.2,18.14 88.9,18.14 88.44,18.59 v87.83,18.59 87.53,18.89 87.53,19.07 86.87,19.73 86.87,22.35 v85.62,23.6 85.6,23.62 | LED8.C@1 85.85,58.17 | LED16.C@1 85.85,54.36 | LED32.C@1 85.85,44.2 | LED40.C@1 85.85,40.13 | LED48.C@1 85.85,36.58 | LED56.C@1 85.85,32.09 | 85.85,32.09 85.85,31.5 | LED64.C@1 85.08,30.23 84.33,30.99 85.43,32.09 85.85,32.09 | v83.57,27.18 82.8,27.94 81.33,27.94 v81.28,27.89 | 85.85,30.34 85.36,30.34 84.48,29.46 v81.53,29.46
  Bottom 0.152: v87.83,18.59 87.38,18.59 82.35,13.56 78.38,13.56 76.25,11.43 JP1.6 | v85.62,23.6 85.09,24.13 83.82,24.13 82.86,25.09 82.86,27.18 v83.57,27.18 | v81.28,27.89 81.28,29.21 v81.53,29.46

### Text on the board
tStop: Shakil Masood / Electrical engineer | T:004740173714 / E:Shakilno3@gmail.com